# EAGLE design OV_FPC_br (EAGLE 5.11)
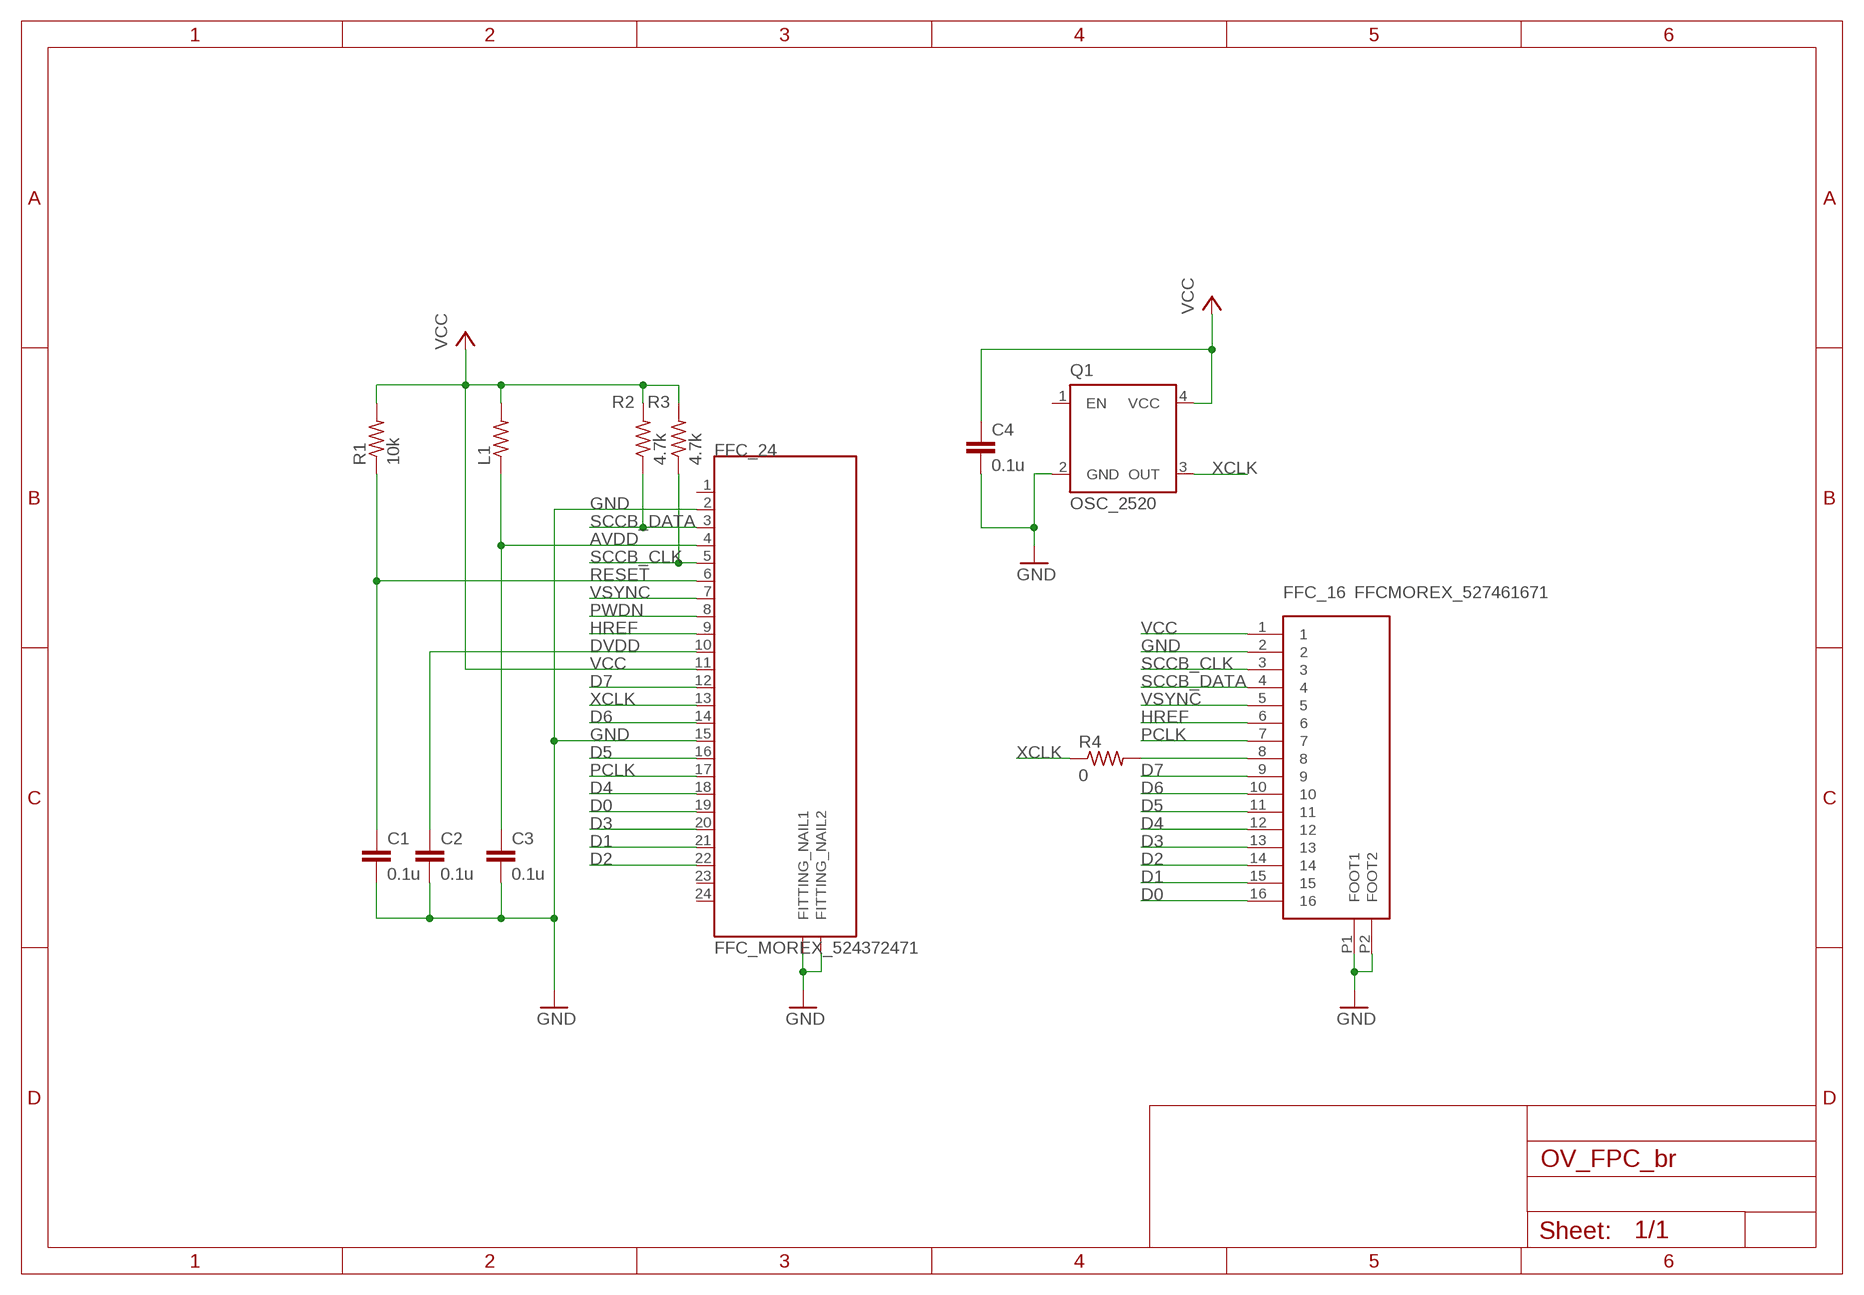
[diagram p0: schematic, sheet 1]

## Parts
C1  0.1u  C-EUC0402  [C1015(0402)]
C2  0.1u  C-EUC0402  [C1015(0402)]
C3  0.1u  C-EUC0402  [C1015(0402)]
C4  0.1u  C-EUC0402  [C1015(0402)]
FFC_16  FFCMOREX_527461671  [MOREX_527461671]
FFC_24  FFC_MOREX_524372471  [MOREX_FFC_24]
L1  R-US_R0603  [R1608M(0603)]
Q1  OSC_2520  [2520]
R1  10k  R-US_R0402  [R1005M(0603)]
R2  4.7k  R-US_R0402  [R1005M(0603)]
R3  4.7k  R-US_R0402  [R1005M(0603)]
R4  0  R-US_R0402  [R1005M(0603)]

## Nets
AVDD: C3.1 FFC_24.4 L1.1
D0: FFC_16.16 FFC_24.19
D1: FFC_16.15 FFC_24.21
D2: FFC_16.14 FFC_24.22
D3: FFC_16.13 FFC_24.20
D4: FFC_16.12 FFC_24.18
D5: FFC_16.11 FFC_24.16
D6: FFC_16.10 FFC_24.14
D7: FFC_16.9 FFC_24.12
DVDD: C2.1 FFC_24.10
GND: C1.2 C2.2 C3.2 C4.2 FFC_16.2 FFC_16.P1(FOOT1) FFC_16.P2(FOOT2) FFC_24.2 FFC_24.15 FFC_24.P$1(FITTING_NAIL1) FFC_24.P$2(FITTING_NAIL2) Q1.2(GND)
HREF: FFC_16.6 FFC_24.9
N$1: FFC_16.8 R4.2
PCLK: FFC_16.7 FFC_24.17
PWDN: FFC_24.8
RESET: C1.1 FFC_24.6 R1.1
SCCB_CLK: FFC_16.3 FFC_24.5 R3.1
SCCB_DATA: FFC_16.4 FFC_24.3 R2.1
VCC: C4.1 FFC_16.1 FFC_24.11 L1.2 Q1.4(VCC) R1.2 R2.2 R3.2
VSYNC: FFC_16.5 FFC_24.7
XCLK: FFC_24.13 Q1.3(OUT) R4.1
Unconnected: FFC_24.1 FFC_24.23 FFC_24.24 Q1.1(EN)

## Library data of the parts
C1-C4 = capacitor:C-EU: CAPACITOR, European symbol
FFC_16 = FPC:FFCMOREX_527461671
FFC_24 = FPC:FFC_MOREX_524372471: Morex http://www.digikey.jp/product-detail/ja/0524372471/WM7980CT-ND/2074169
L1 R1-R4 = Resistor:R-US_: RESISTOR, American symbol
Q1 = OSC:OSC_2520

## Board
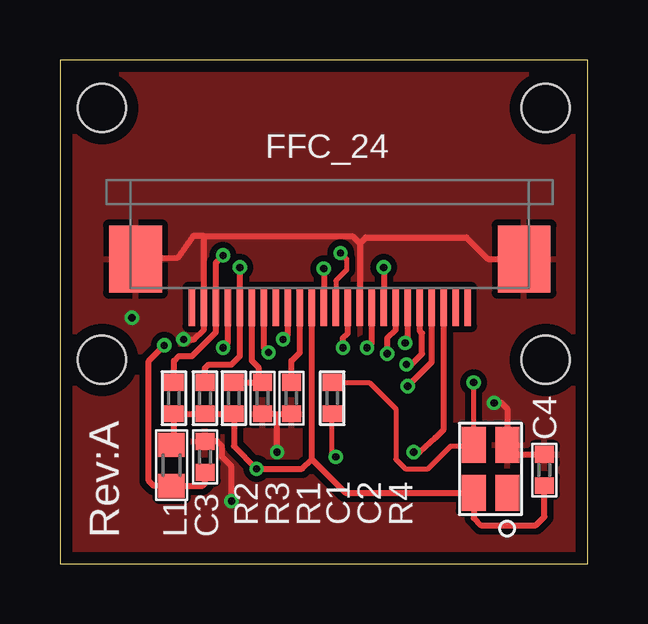
[diagram p1: board, top side]
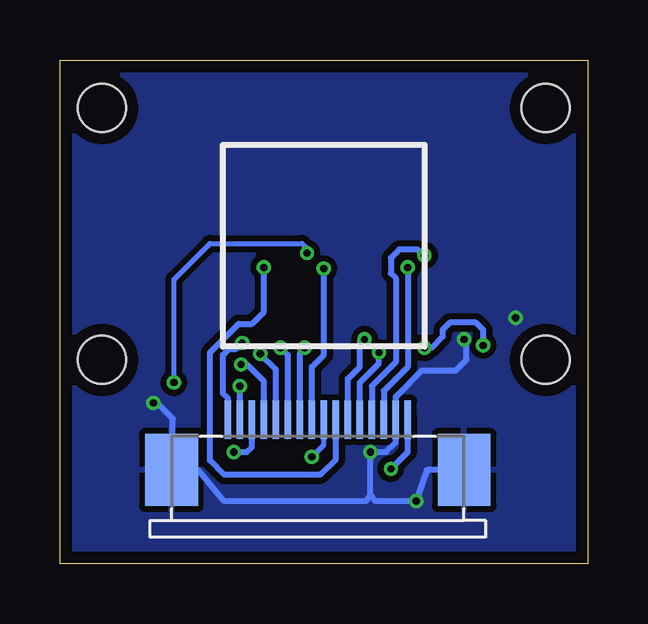
[diagram p2: board, bottom side, seen from below]

Size 22 x 21 mm. Coordinates in mm from the lower left corner, seen from the top.
Outline: 0,0 22,0 22,21 0,21 0,0
Copper layers (1*16): Top 0.035mm / dielectric 1.53mm / Bottom 0.035mm
Design rules "pban_4mil-l2": minimum track width 0.1mm, minimum drill 0.3mm, track to track 0.1mm, track to pad 0.229mm, pad to pad 0.1mm, via to via 0.1mm, smd to smd 0.1mm, copper to edge 0.5mm, drill to drill 0.5mm, minimum pad ring 0.15mm, minimum via ring 0.15mm, stop-mask expansion 4mil, vias tented up to drill 0.35mm, thermal gap 10mil
Holes 2 mm at 1.75,19 1.75,8.5 20.25,8.5 20.25,19

### Footprints (pad centres in the part's own frame; a part is rotated, then mirrored left to right if it is on the bottom)
C1015(0402) = smd 0.7 x 0.8: 1 -0.65,0; 2 0.65,0
MOREX_527461671 = smd 0.28 x 1.6: 1 -3.75,0; 2 -3.25,0; 3 -2.75,0; 4 -2.25,0; 5 -1.75,0; 6 -1.25,0; 7 -0.75,0; 8 -0.25,0; 9 0.25,0; 10 0.75,0; 11 1.25,0; 12 1.75,0; 13 2.25,0; 14 2.75,0; 15 3.25,0; 16 3.75,0 | smd 2.2 x 3: P1 -6.1,2.1; P2 6.1,2.1
MOREX_FFC_24 = smd 0.28 x 1.6: 1 -5.75,-0.8; 2 -5.25,-0.8; 3 -4.75,-0.8; 4 -4.25,-0.8; 5 -3.75,-0.8; 6 -3.25,-0.8; 7 -2.75,-0.8; 8 -2.25,-0.8; 9 -1.75,-0.8; 10 -1.25,-0.8; 11 -0.75,-0.8; 12 -0.25,-0.8; 13 0.25,-0.8; 14 0.75,-0.8; 15 1.25,-0.8; 16 1.75,-0.8; 17 2.25,-0.8; 18 2.75,-0.8; 19 3.25,-0.8; 20 3.75,-0.8; 21 4.25,-0.8; 22 4.75,-0.8; 23 5.25,-0.8; 24 5.75,-0.8 | smd 2.2 x 2.8: P$1 -8.1,1.2; P$2 8.1,1.2
R1608M(0603) = smd 1 x 1.1: 1 -0.85,0; 2 0.85,0
2520 = smd 1.5 x 1: 1 -1,-0.7; 2 1,-0.7; 3 1,0.7; 4 -1,0.7
R1005M(0603) = smd 0.7 x 0.8: 1 -0.65,0; 2 0.65,0

### Placement (x,y rotation side)
C1  8.45,6.9 270 top
C2  9.65,6.9 270 top
C3  6.05,4.45 90 top
C4  20.2,3.9 90 top
FFC_16  11.25,6 180 bottom
FFC_24  11.25,11.5 0 top
L1  4.65,4.1 90 top
Q1  17.95,3.95 90 top
R1  7.25,6.9 270 top
R2  4.75,6.9 270 top
R3  6.05,6.9 270 top
R4  11.35,6.9 270 top

### Tracks (layer width: path | path; a pad name or v marks a point on that pad's centre or on a via)
AVDD  (via drill 0.3)
  Top 0.254: C3.1 6.05,3.35 5.95,3.25 L1.1 3.9,3.25 3.7,3.45 3.7,8.45 v4.35,9.1 | FFC_24.4 7,9.2 v6.8,9
  Bottom 0.254: v6.8,9 6.5,9 6.05,9.45 6.05,9.75 5.75,10.05 4.65,10.05 4.35,9.75 v4.35,9.1
D0  (via drill 0.3)
  Top 0.254: v14.4,9.2 14.5,9.3 FFC_24.19
  Bottom 0.254: v14.4,9.2 14.65,8.95 14.95,8.95 15.2,8.7 15.2,7.1 15,6.9 FFC_16.16
D1  (via drill 0.3)
  Top 0.254: FFC_24.21 15.5,8.4 v14.5,7.4
  Bottom 0.254: FFC_16.15 v14.5,7.4
D2  (via drill 0.3)
  Top 0.254: FFC_24.22 16,5.6 15.65,5.25 15,4.65 v14.75,4.65
  Bottom 0.254: v14.75,4.65 14.2,4.65 14,4.85 FFC_16.14
D3  (via drill 0.3)
  Top 0.254: FFC_24.20 15,9.7 15.1,9.6 15.1,8.75 14.65,8.3 v14.45,8.3
  Bottom 0.254: v14.45,8.3 14.2,8.3 13.5,7.6 FFC_16.13
D4  (via drill 0.3)
  Top 0.254: v13.65,8.75 13.65,9.4 14,9.75 FFC_24.18
  Bottom 0.254: FFC_16.12 13,8.1 v13.65,8.75
D5  (via drill 0.3)
  Top 0.254: FFC_24.16 13,9.2 v12.8,9
  Bottom 0.254: v12.8,9 12.5,8.7 FFC_16.11
D6  (via drill 0.3)
  Top 0.254: v11.8,9 11.8,9.4 12,9.6 FFC_24.14
  Bottom 0.254: FFC_16.10 12,8.75 11.8,8.95 v11.8,9
D7  (via drill 0.3)
  Top 0.254: v11,12.3 FFC_24.12
  Bottom 0.254: FFC_16.9 11.5,8.2 11,8.7 v11,12.3
DVDD
  Top 0.254: C2.1 9.65,8.45 10,8.8 FFC_24.10
GND  (via drill 0.3)
  Top 0.254: FFC_24.P$2 17.85,12.7 16.95,13.6 12.75,13.6 12.5,13.35 | 12.5,13.35 FFC_24.15 | 12.5,13.35 12.2,13.65 6,13.65 | 6,13.65 5.55,13.65 4.9,12.75 FFC_24.P$1 | 8.95,6.25 C2.2 | 8.95,6.25 C1.2 | v9.05,4.65 9.05,6.15 8.95,6.25 | 6,13.65 FFC_24.2 6,9.75 5.6,9.35 v5.15,9.35 | C3.2 6.55,5.1 6.75,4.9 6.75,4.45 7.15,4.05 v7.15,2.6 | C4.2 19.05,4.55 Q1.2 18.65,6.45 18.4,6.7 v18.1,6.7
  Bottom 0.254: FFC_16.P1 6.7,3.9 v7.15,2.6 8.85,2.6 9.05,2.9 | 9.05,2.9 v9.05,4.65 8.4,4.65 8,5.05 FFC_16.2 8,6.95 6.9,8.05 5.5,8.05 5.05,8.5 5.05,9.15 v5.15,9.35 | 9.05,2.9 9.25,2.6 15.15,2.6 16.25,3.9 FFC_16.P2 17.3,3.95 17.3,6.05 17.95,6.7 v18.1,6.7
  other vias: 3,10.25
  pour Top (isolate 0.254): 0,21 0,0 22,0 22,21
  pour Bottom (isolate 0.254): 0,21 0,0 22,0 22,21
HREF  (via drill 0.3)
  Top 0.254: FFC_24.9 9.5,9.55 v9.3,9.35
  Bottom 0.254: v9.3,9.35 9.5,9.2 9.5,8.2 10,7.7 FFC_16.6
N$1  (via drill 0.3)
  Top 0.2: R4.2 11.35,4.6 v11.5,4.45
  Bottom 0.2: v11.5,4.45 11,4.95 FFC_16.8
PCLK  (via drill 0.3)
  Top 0.254: v13.5,12.35 FFC_24.17
  Bottom 0.254: v13.5,12.35 13.5,10.5 14,10 14.55,10 15.75,8.8 15.75,4.3 15.15,3.7 11.15,3.7 10.5,4.35 FFC_16.7
RESET
  Top 0.254: R1.1 8.3,7.55 | 8.3,7.55 C1.1 | FFC_24.6 8,8.45 8.3,8.15 8.3,7.55
SCCB_CLK  (via drill 0.3)
  Top 0.254: R3.1 6.05,8.15 6.2,8.3 7.15,8.3 7.5,8.65 FFC_24.5 v7.5,12.35
  Bottom 0.254: FFC_16.3 8.5,7.2 7.5,8.2 v7.5,12.35
SCCB_DATA  (via drill 0.3)
  Top 0.254: R2.1 4.75,8.45 4.95,8.65 5.5,8.65 6.5,9.65 FFC_24.3 6.5,12.55 v6.8,12.85
  Bottom 0.254: v6.8,12.85 7.1,13.1 7.85,13.1 8.2,12.75 8.2,12.1 8,11.9 8,8.4 9,7.4 FFC_16.4
VCC  (via drill 0.3)
  Top 0.254: 10.5,4.35 FFC_24.11 | 10.5,4.35 10.1,3.95 v8.2,3.95 7.25,4.9 R1.2 R3.2 R2.2 4.75,5.2 4.65,5.1 L1.2 | C4.1 20.2,1.95 19.85,1.6 17.55,1.6 17.25,1.9 Q1.4 11.9,2.95 10.5,4.35
  Bottom 0.254: v8.2,3.95 7.5,4.65 FFC_16.1 7.5,6.1
VSYNC  (via drill 0.3)
  Top 0.254: FFC_24.7 8.5,9 v8.7,8.8
  Bottom 0.254: v8.7,8.8 8.7,8.35 9.5,7.55 FFC_16.5
XCLK  (via drill 0.3)
  Top 0.2: FFC_24.13 11.5,11.8 11.95,12.25 11.95,12.7 v11.7,12.95 | v17.25,7.55 Q1.3 17.2,4.9 16.3,4.9 15.35,3.95 14.4,3.95 14,4.35 14,6.45 12.9,7.55 R4.1
  Bottom 0.2: v11.7,12.95 11.7,13.15 11.9,13.35 15.75,13.35 17.25,11.85 v17.25,7.55

### Text on the board
tPlace: Rev:A